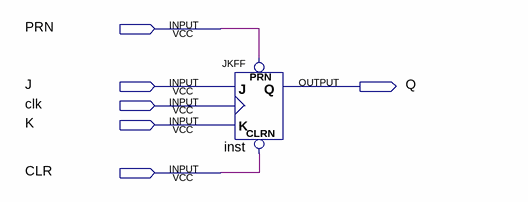
[diagram p0: schematic sheet]
// Quartus schematic Jkcfq.bdf as structural Verilog: 1 symbols, 6 pins
module Jkcfq (
  input  PRN,
  input  J,
  input  clk,
  input  K,
  input  CLR,
  output Q
);

  JKFF inst (.PRN(PRN), .CLRN(CLR), .K(K), .J(J), .CLK(clk), .Q(Q));
endmodule
